# EasyEDA schematic SCH_Dual OPN MegaMod_2021-11-08.json

## Sheets
1 MAIN: TITLE: Sheet_1; REV: 1.0; Date: 2021-11-07; Sheet: 1/1; Drawn By: Denjhang; Company: Your Company
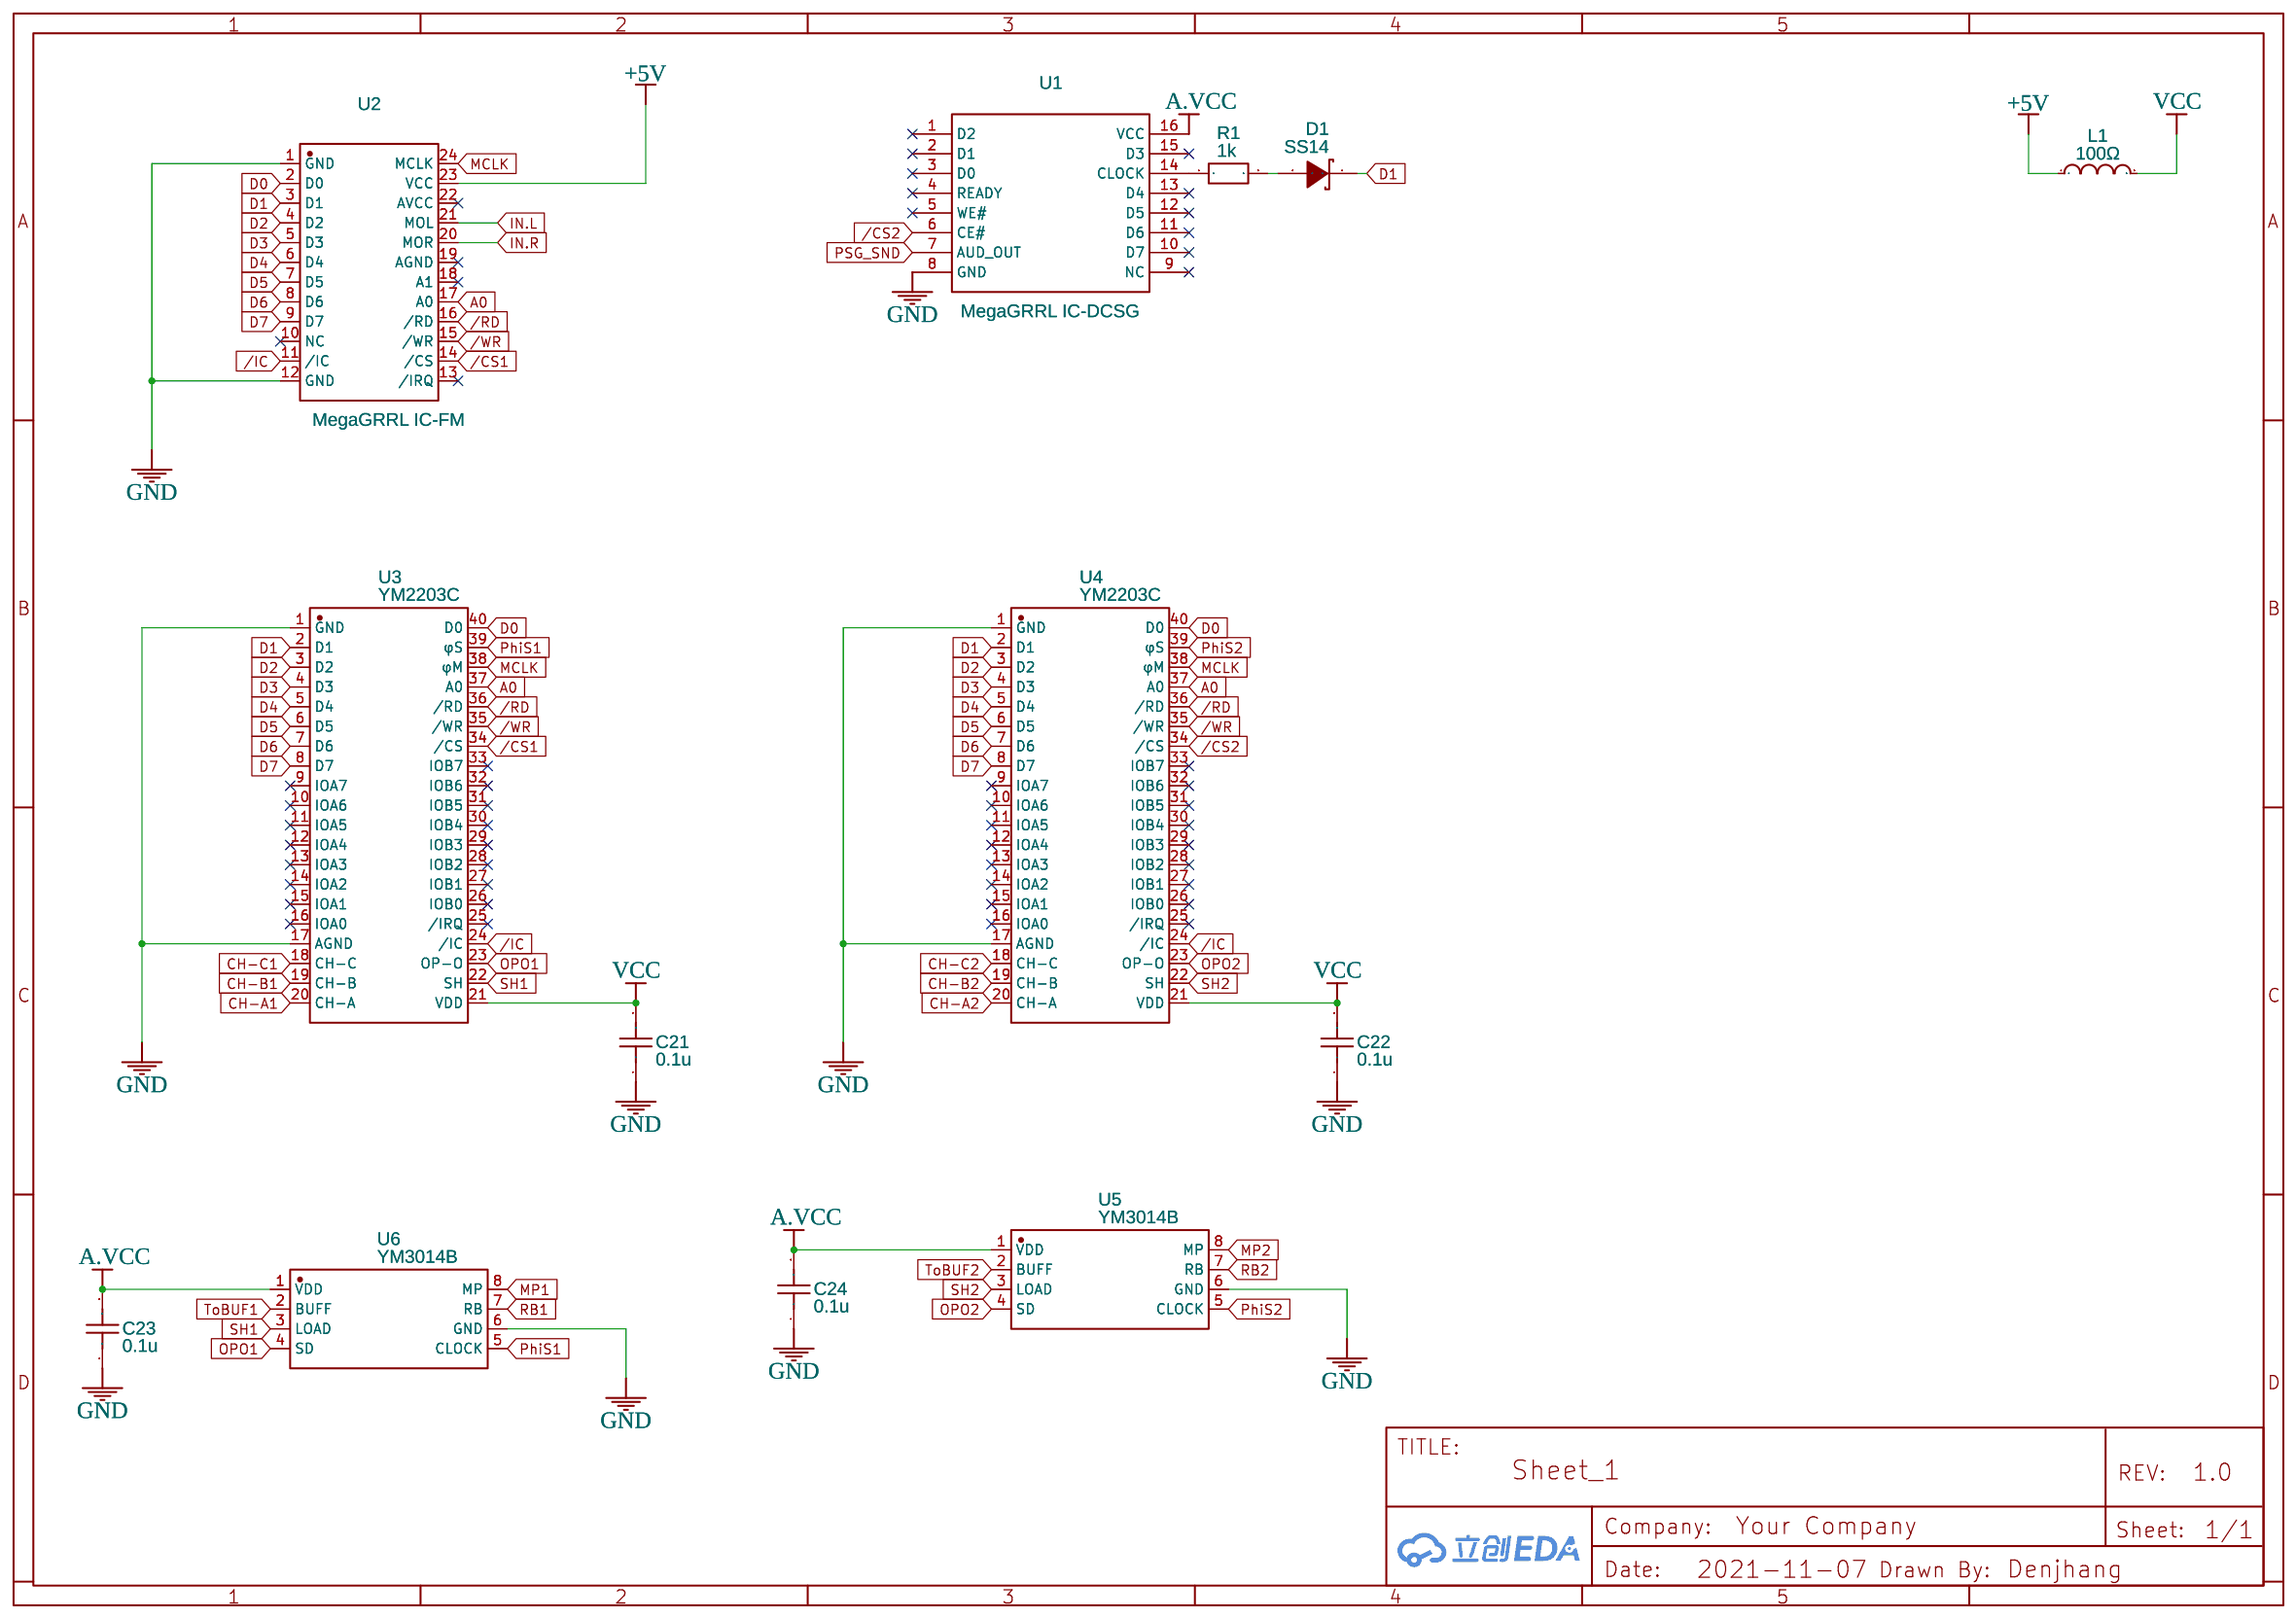
[diagram p0: MAIN]
2 MIX_PSG
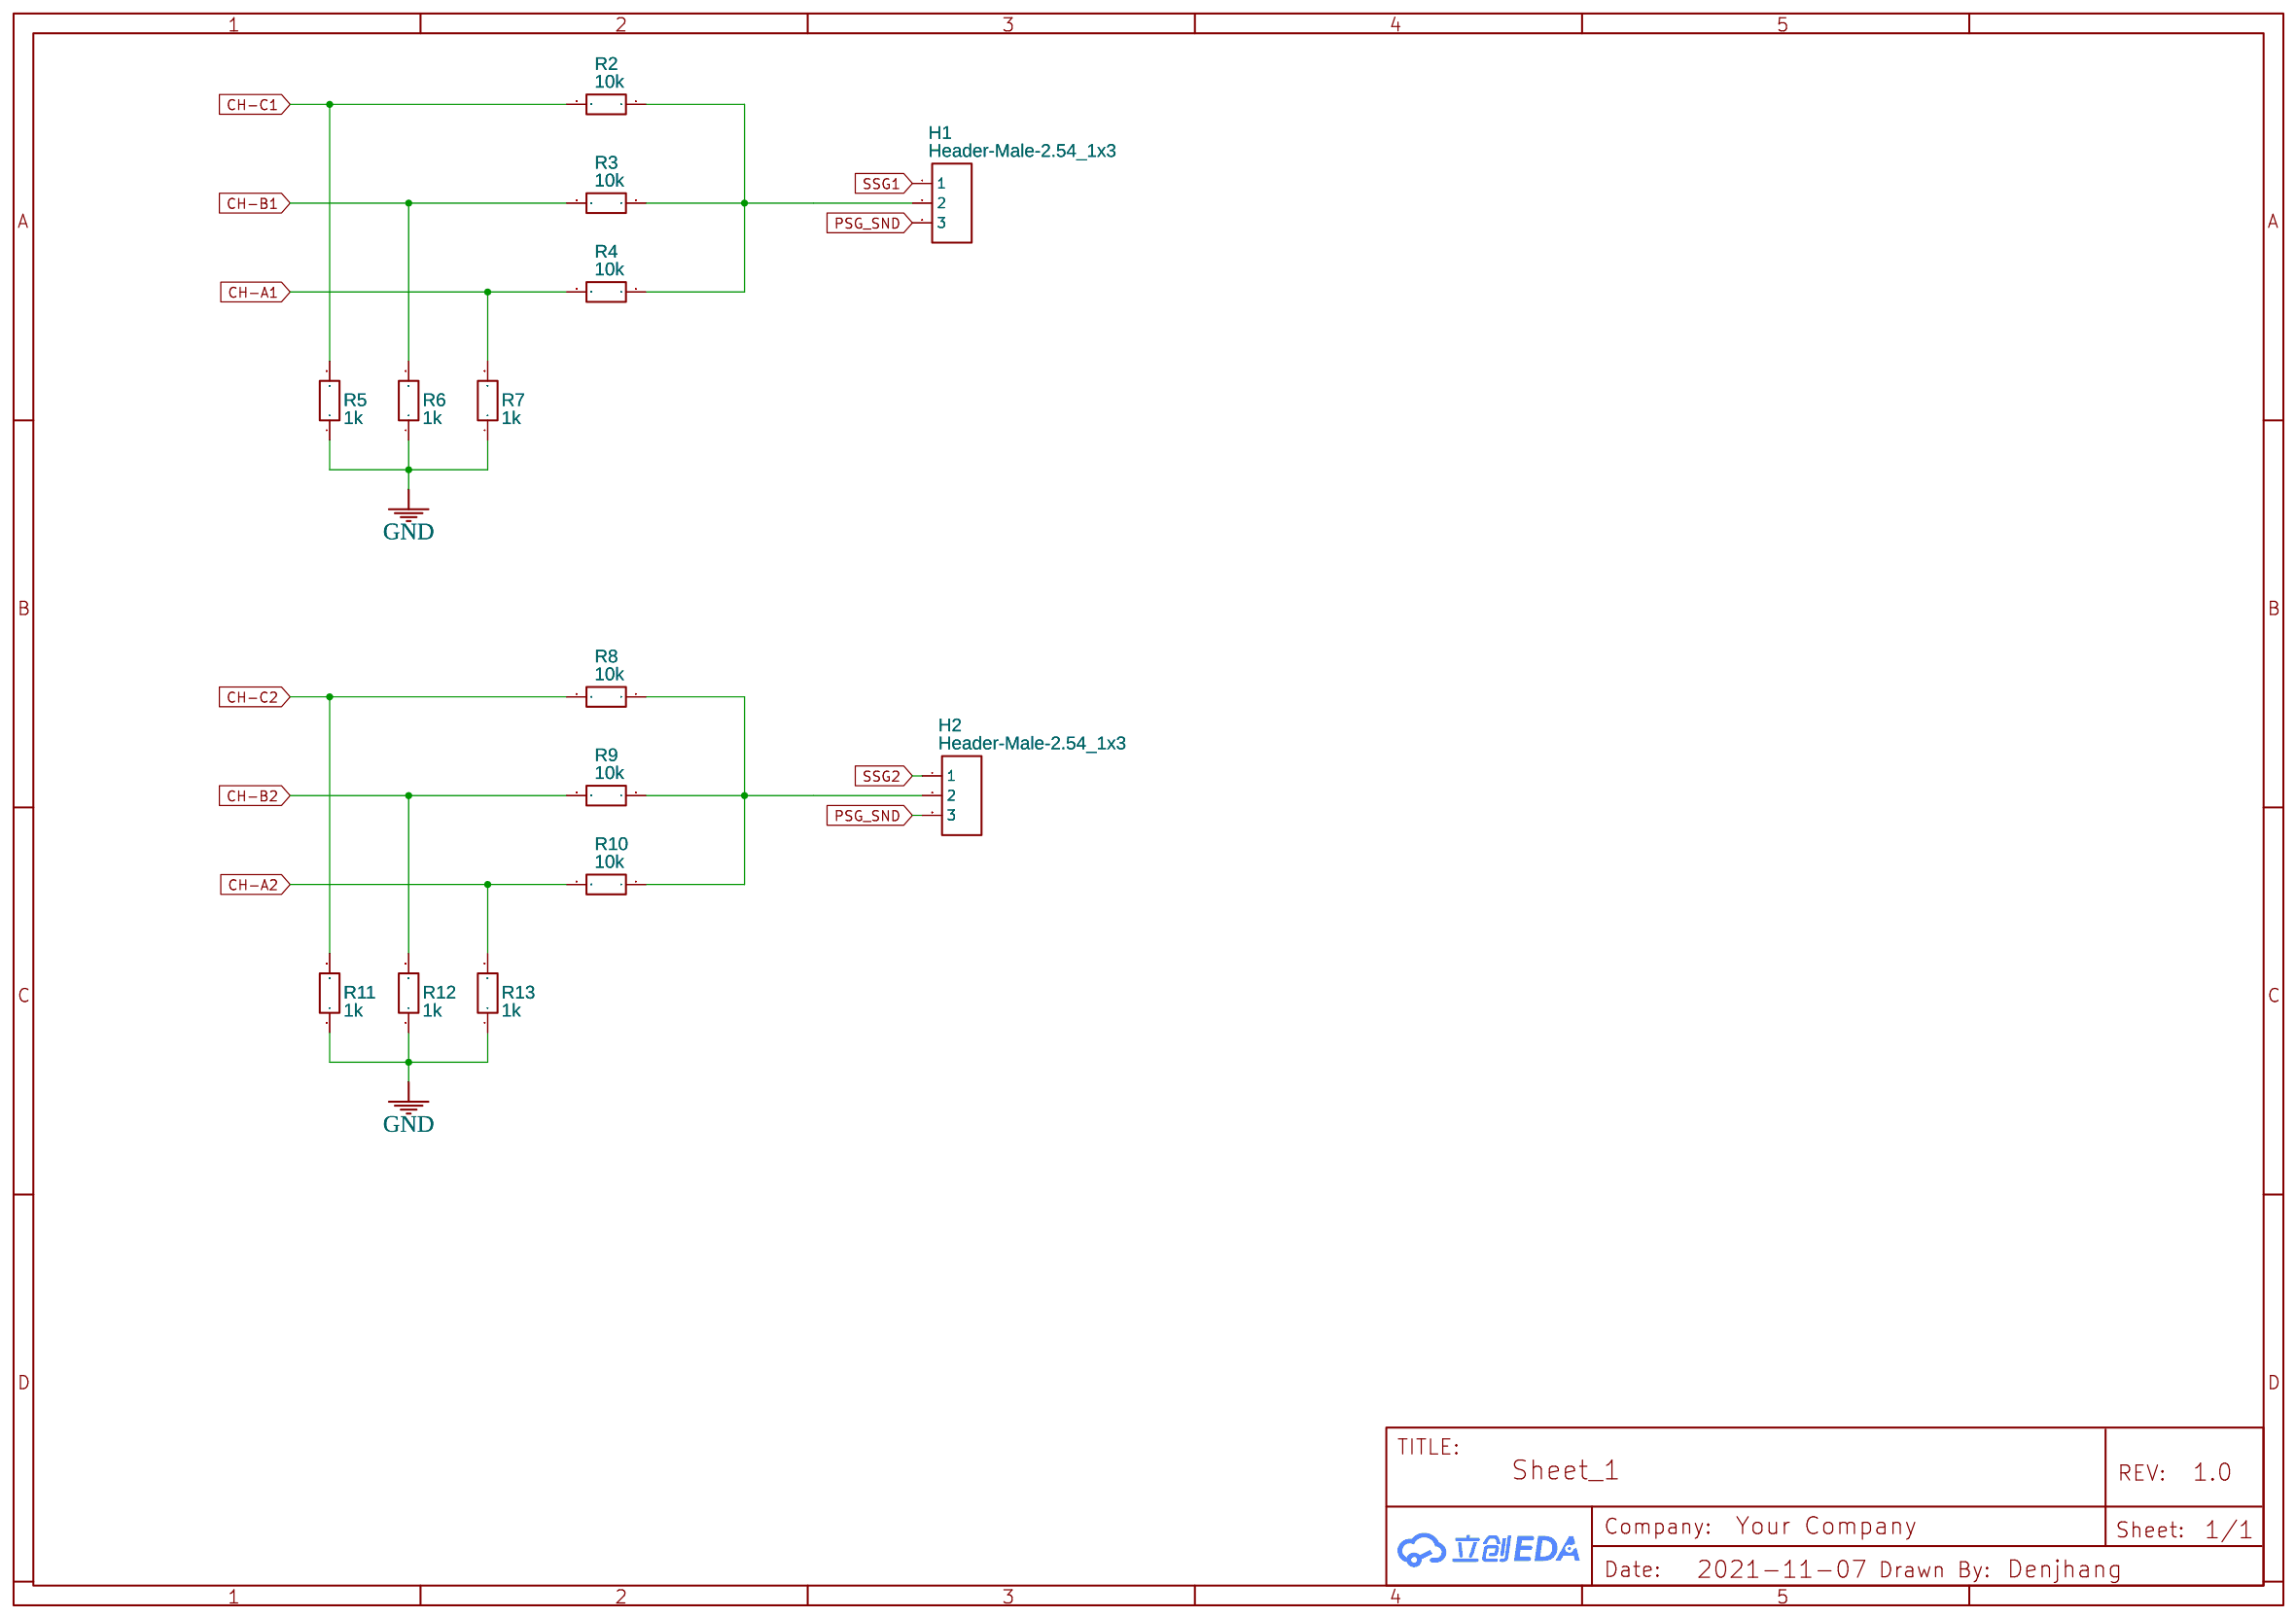
[diagram p1: MIX_PSG]
3 AMP_FM1
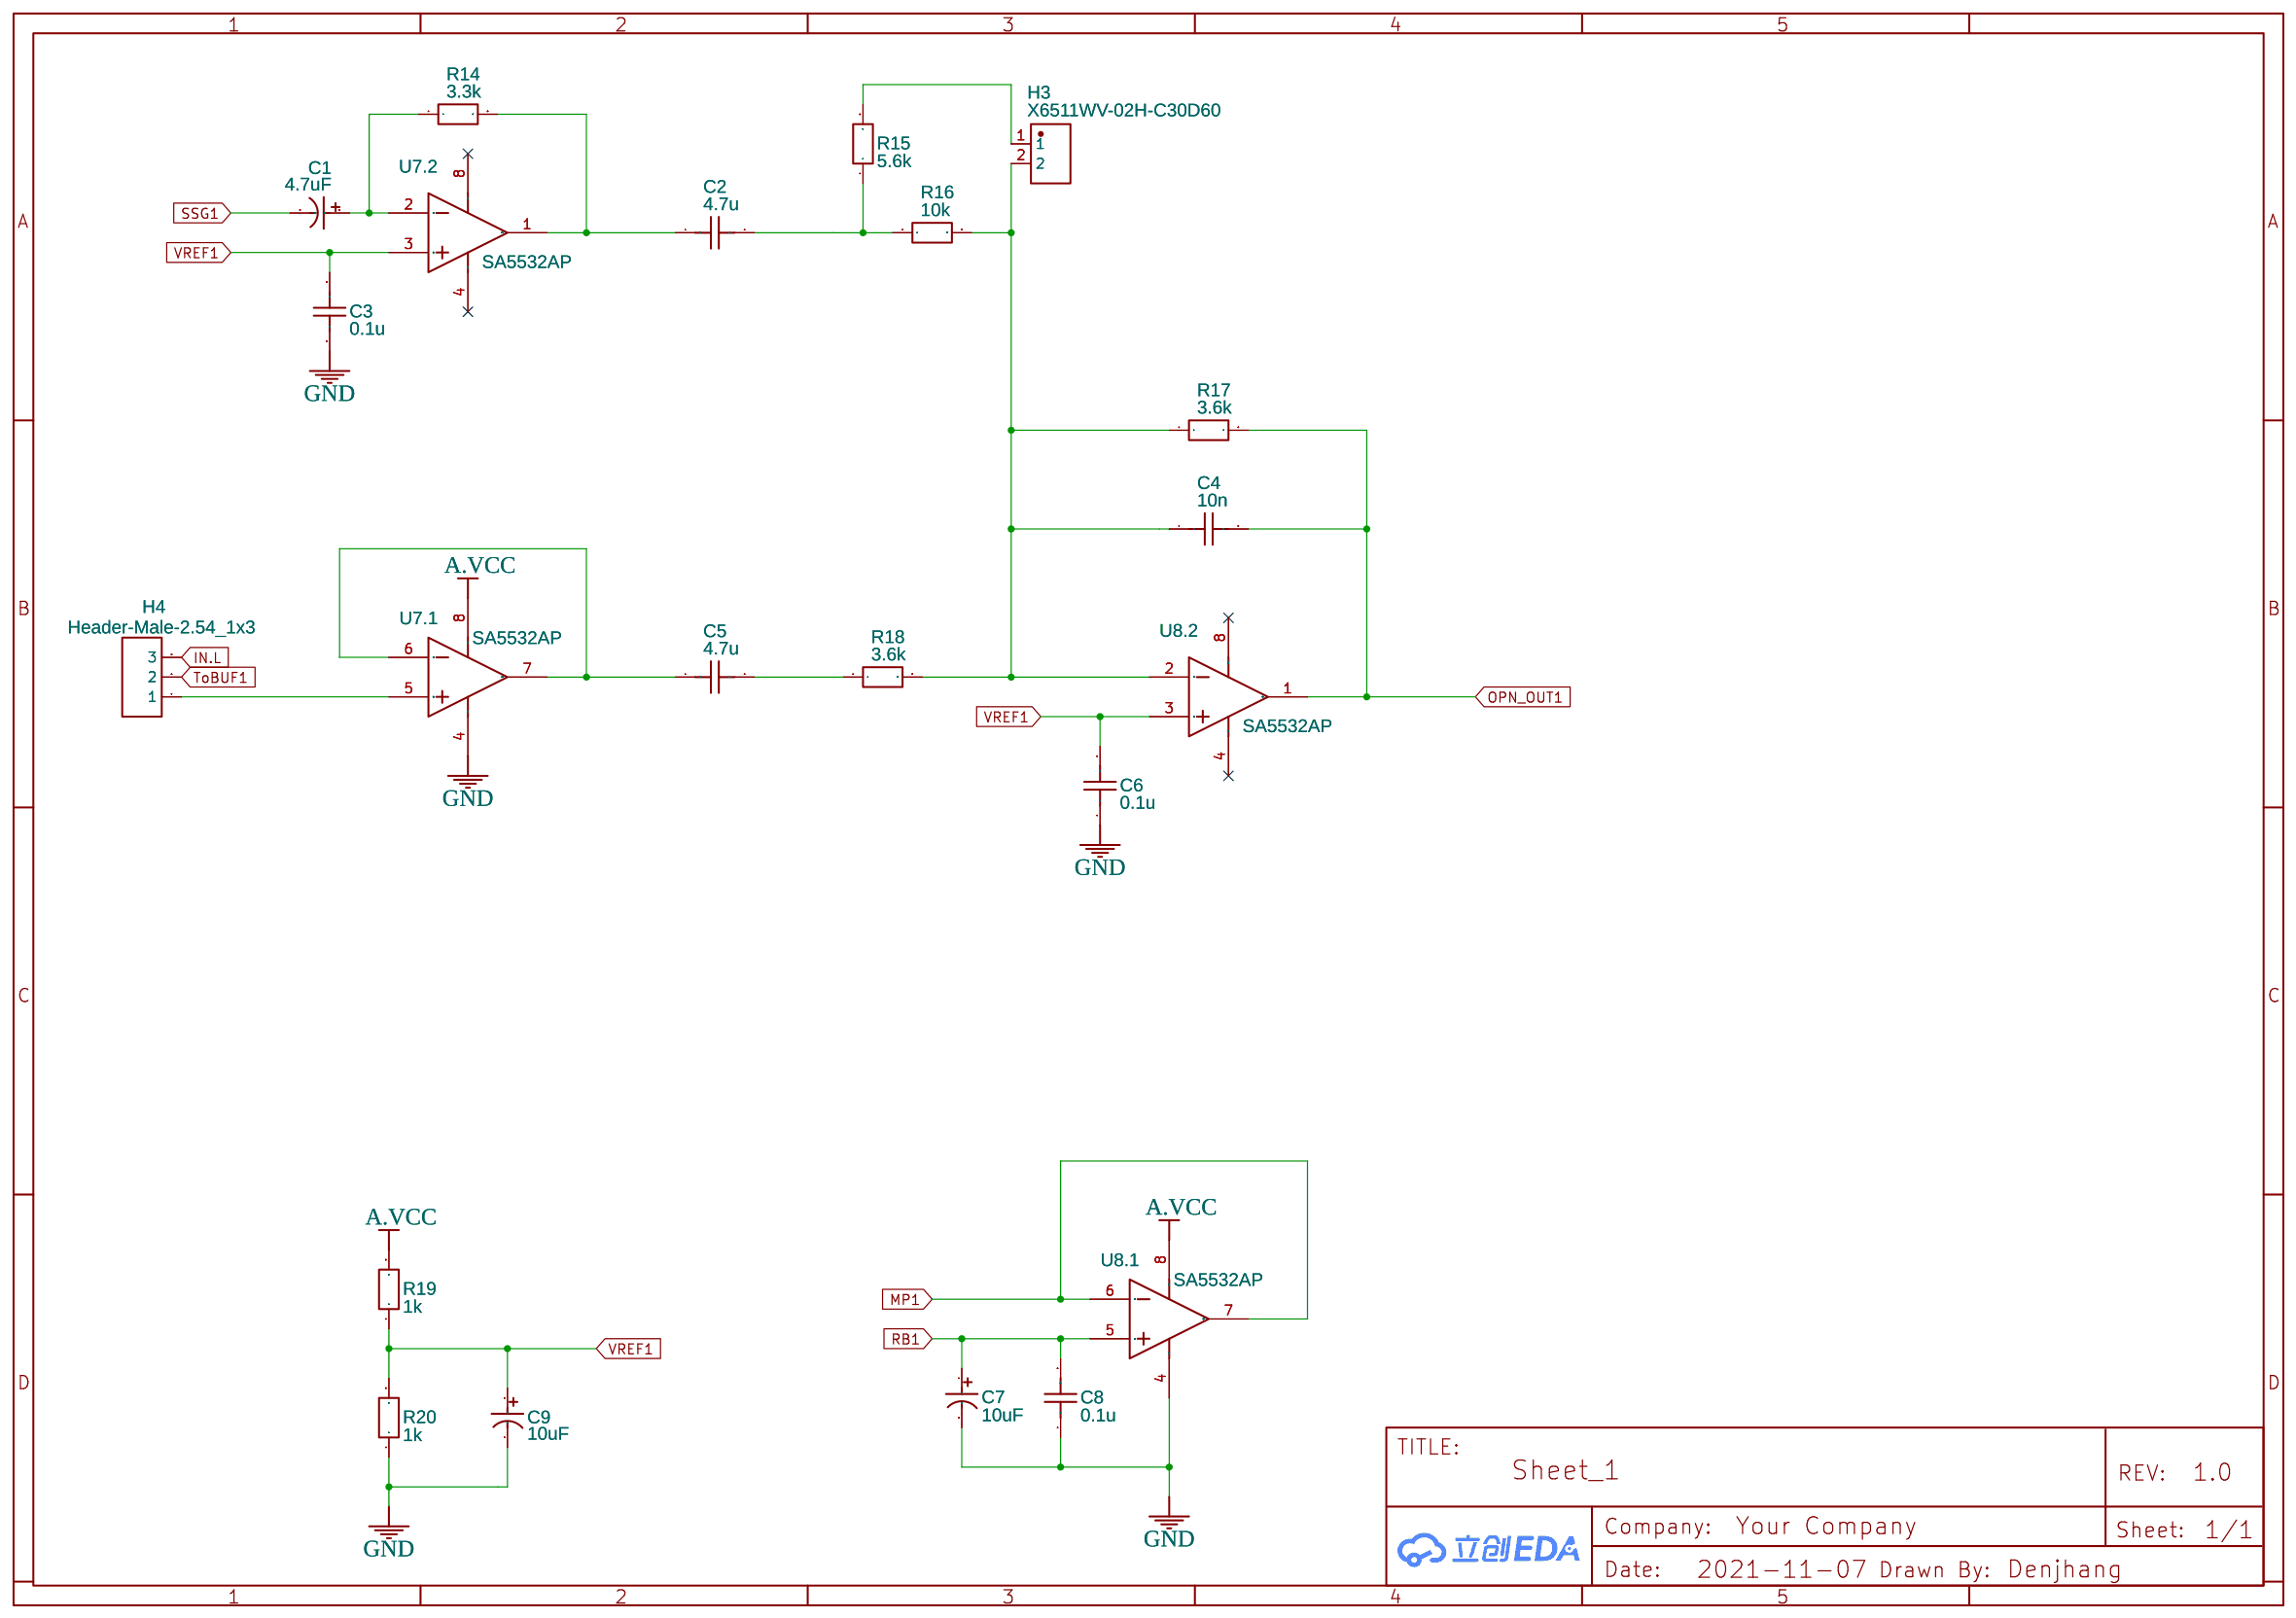
[diagram p2: AMP_FM1]
4 AMP_FM2
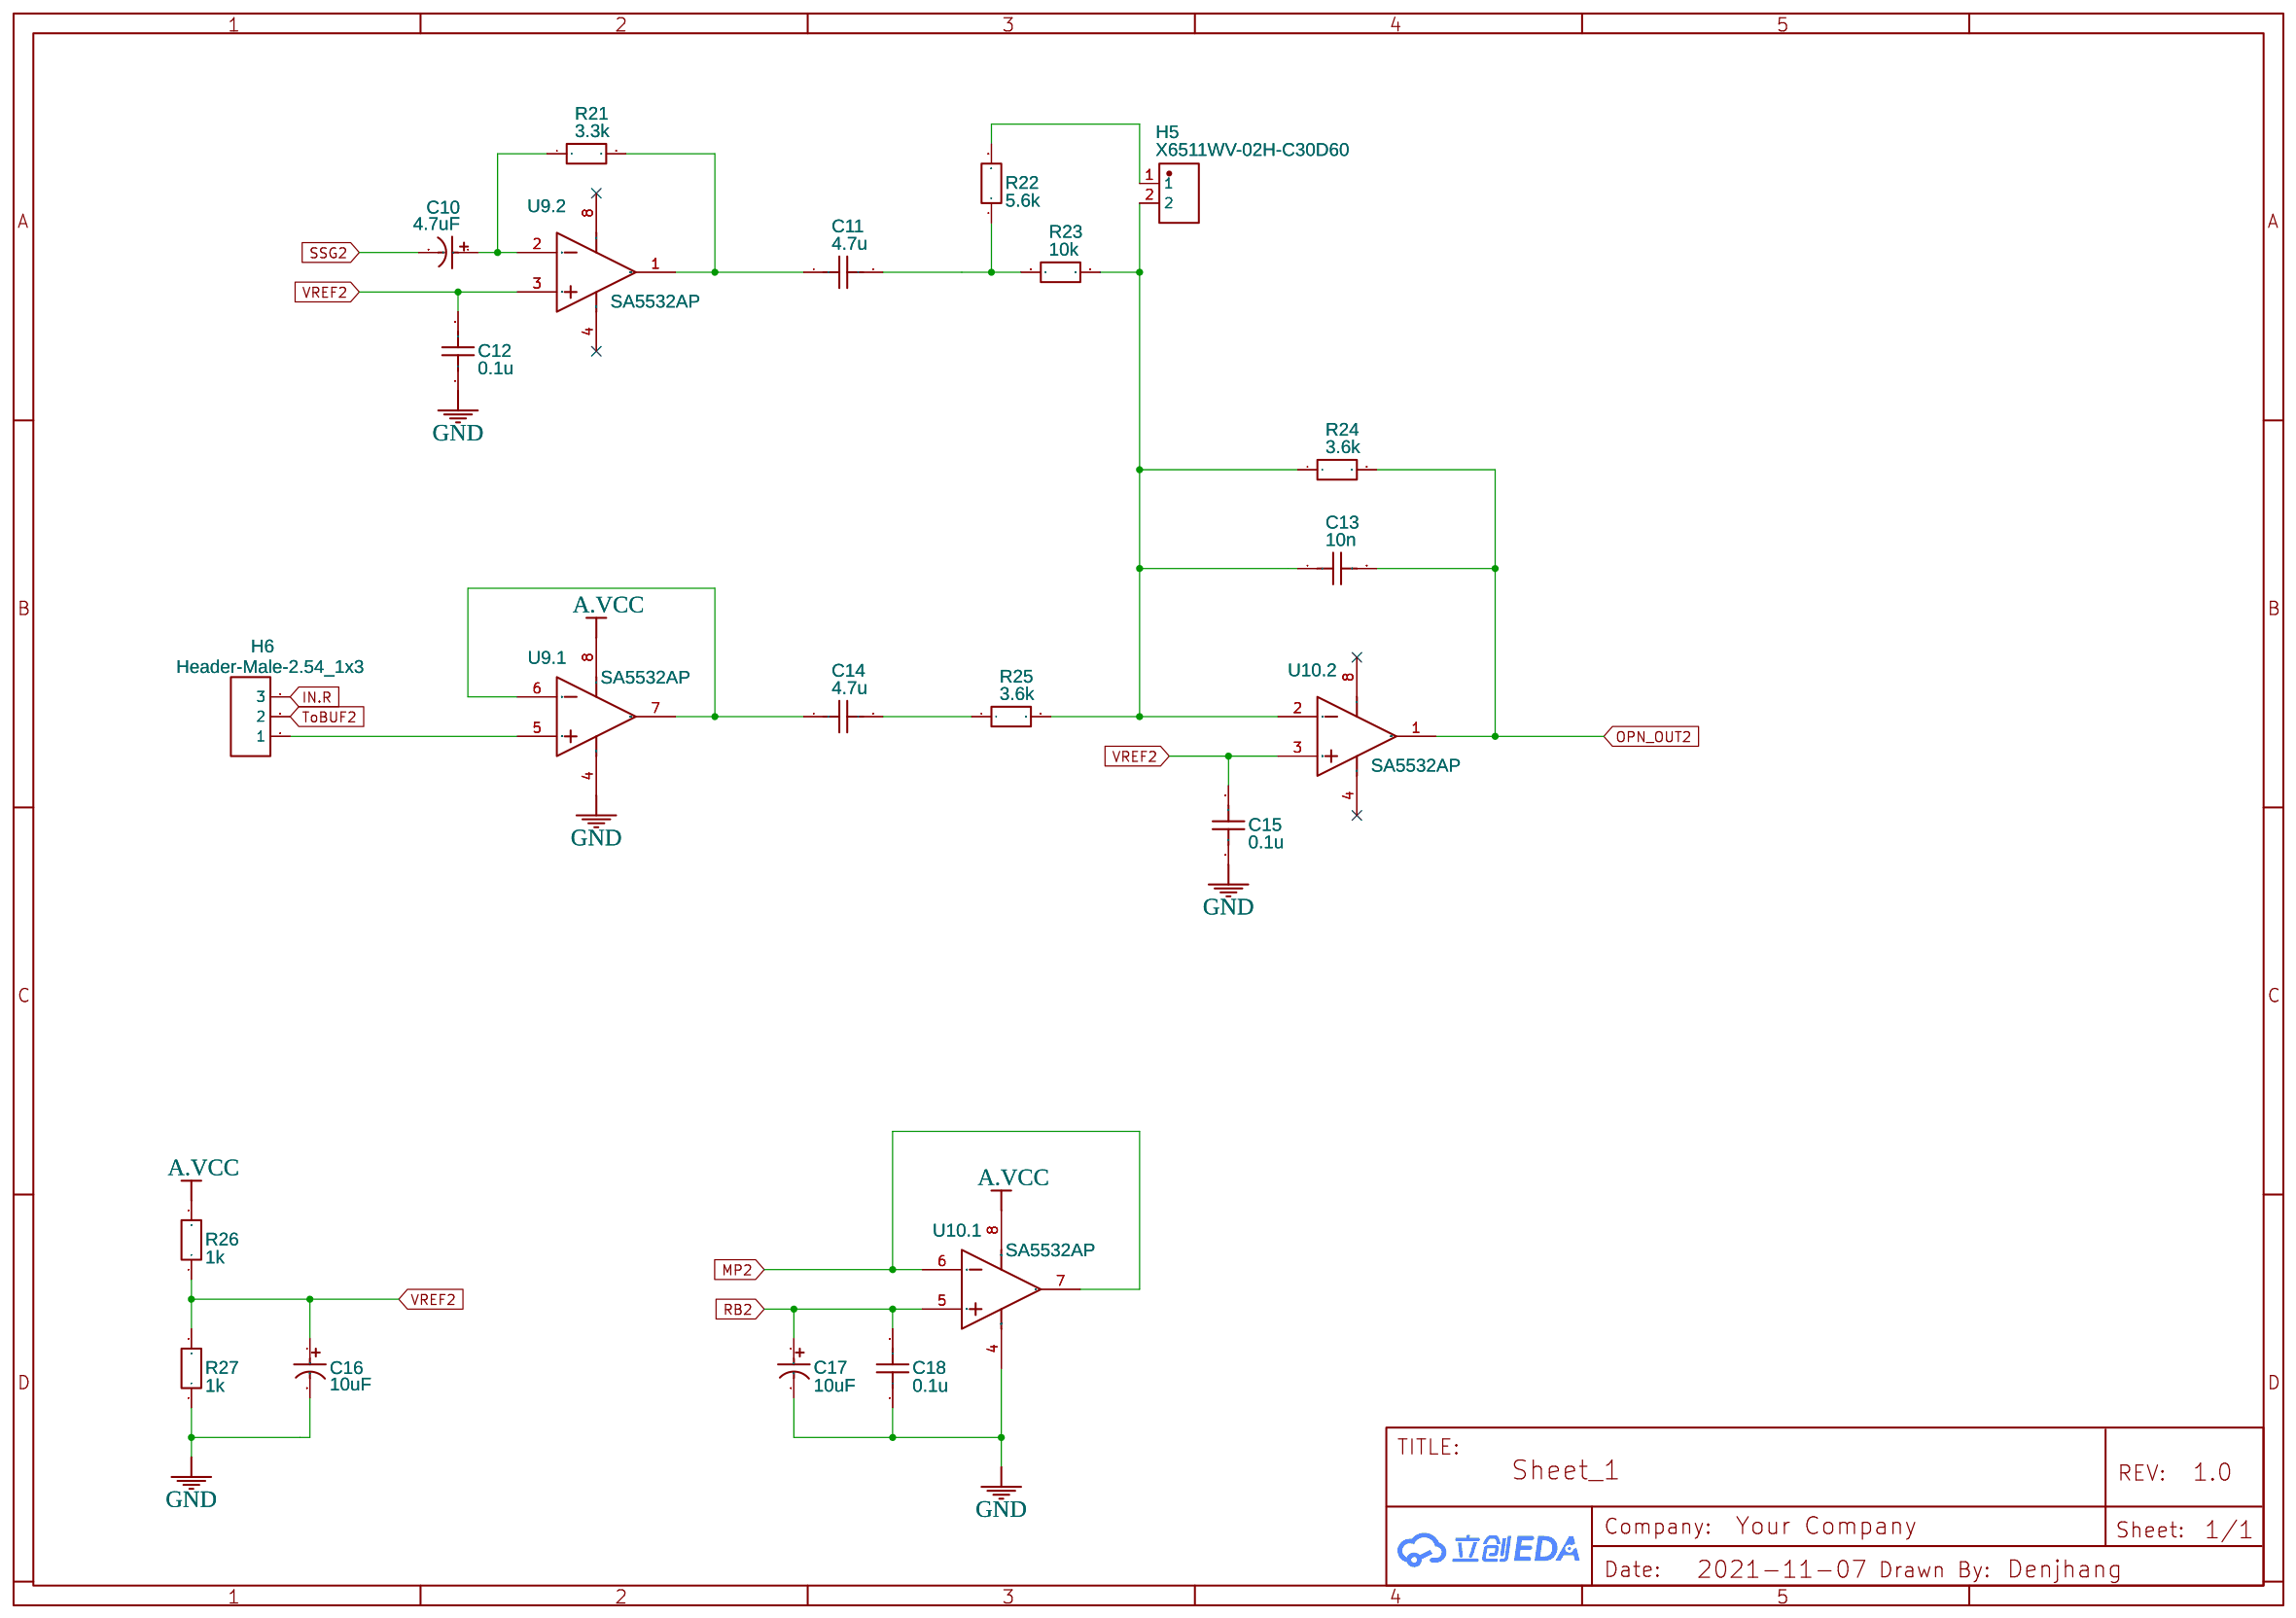
[diagram p3: AMP_FM2]
5 OUT
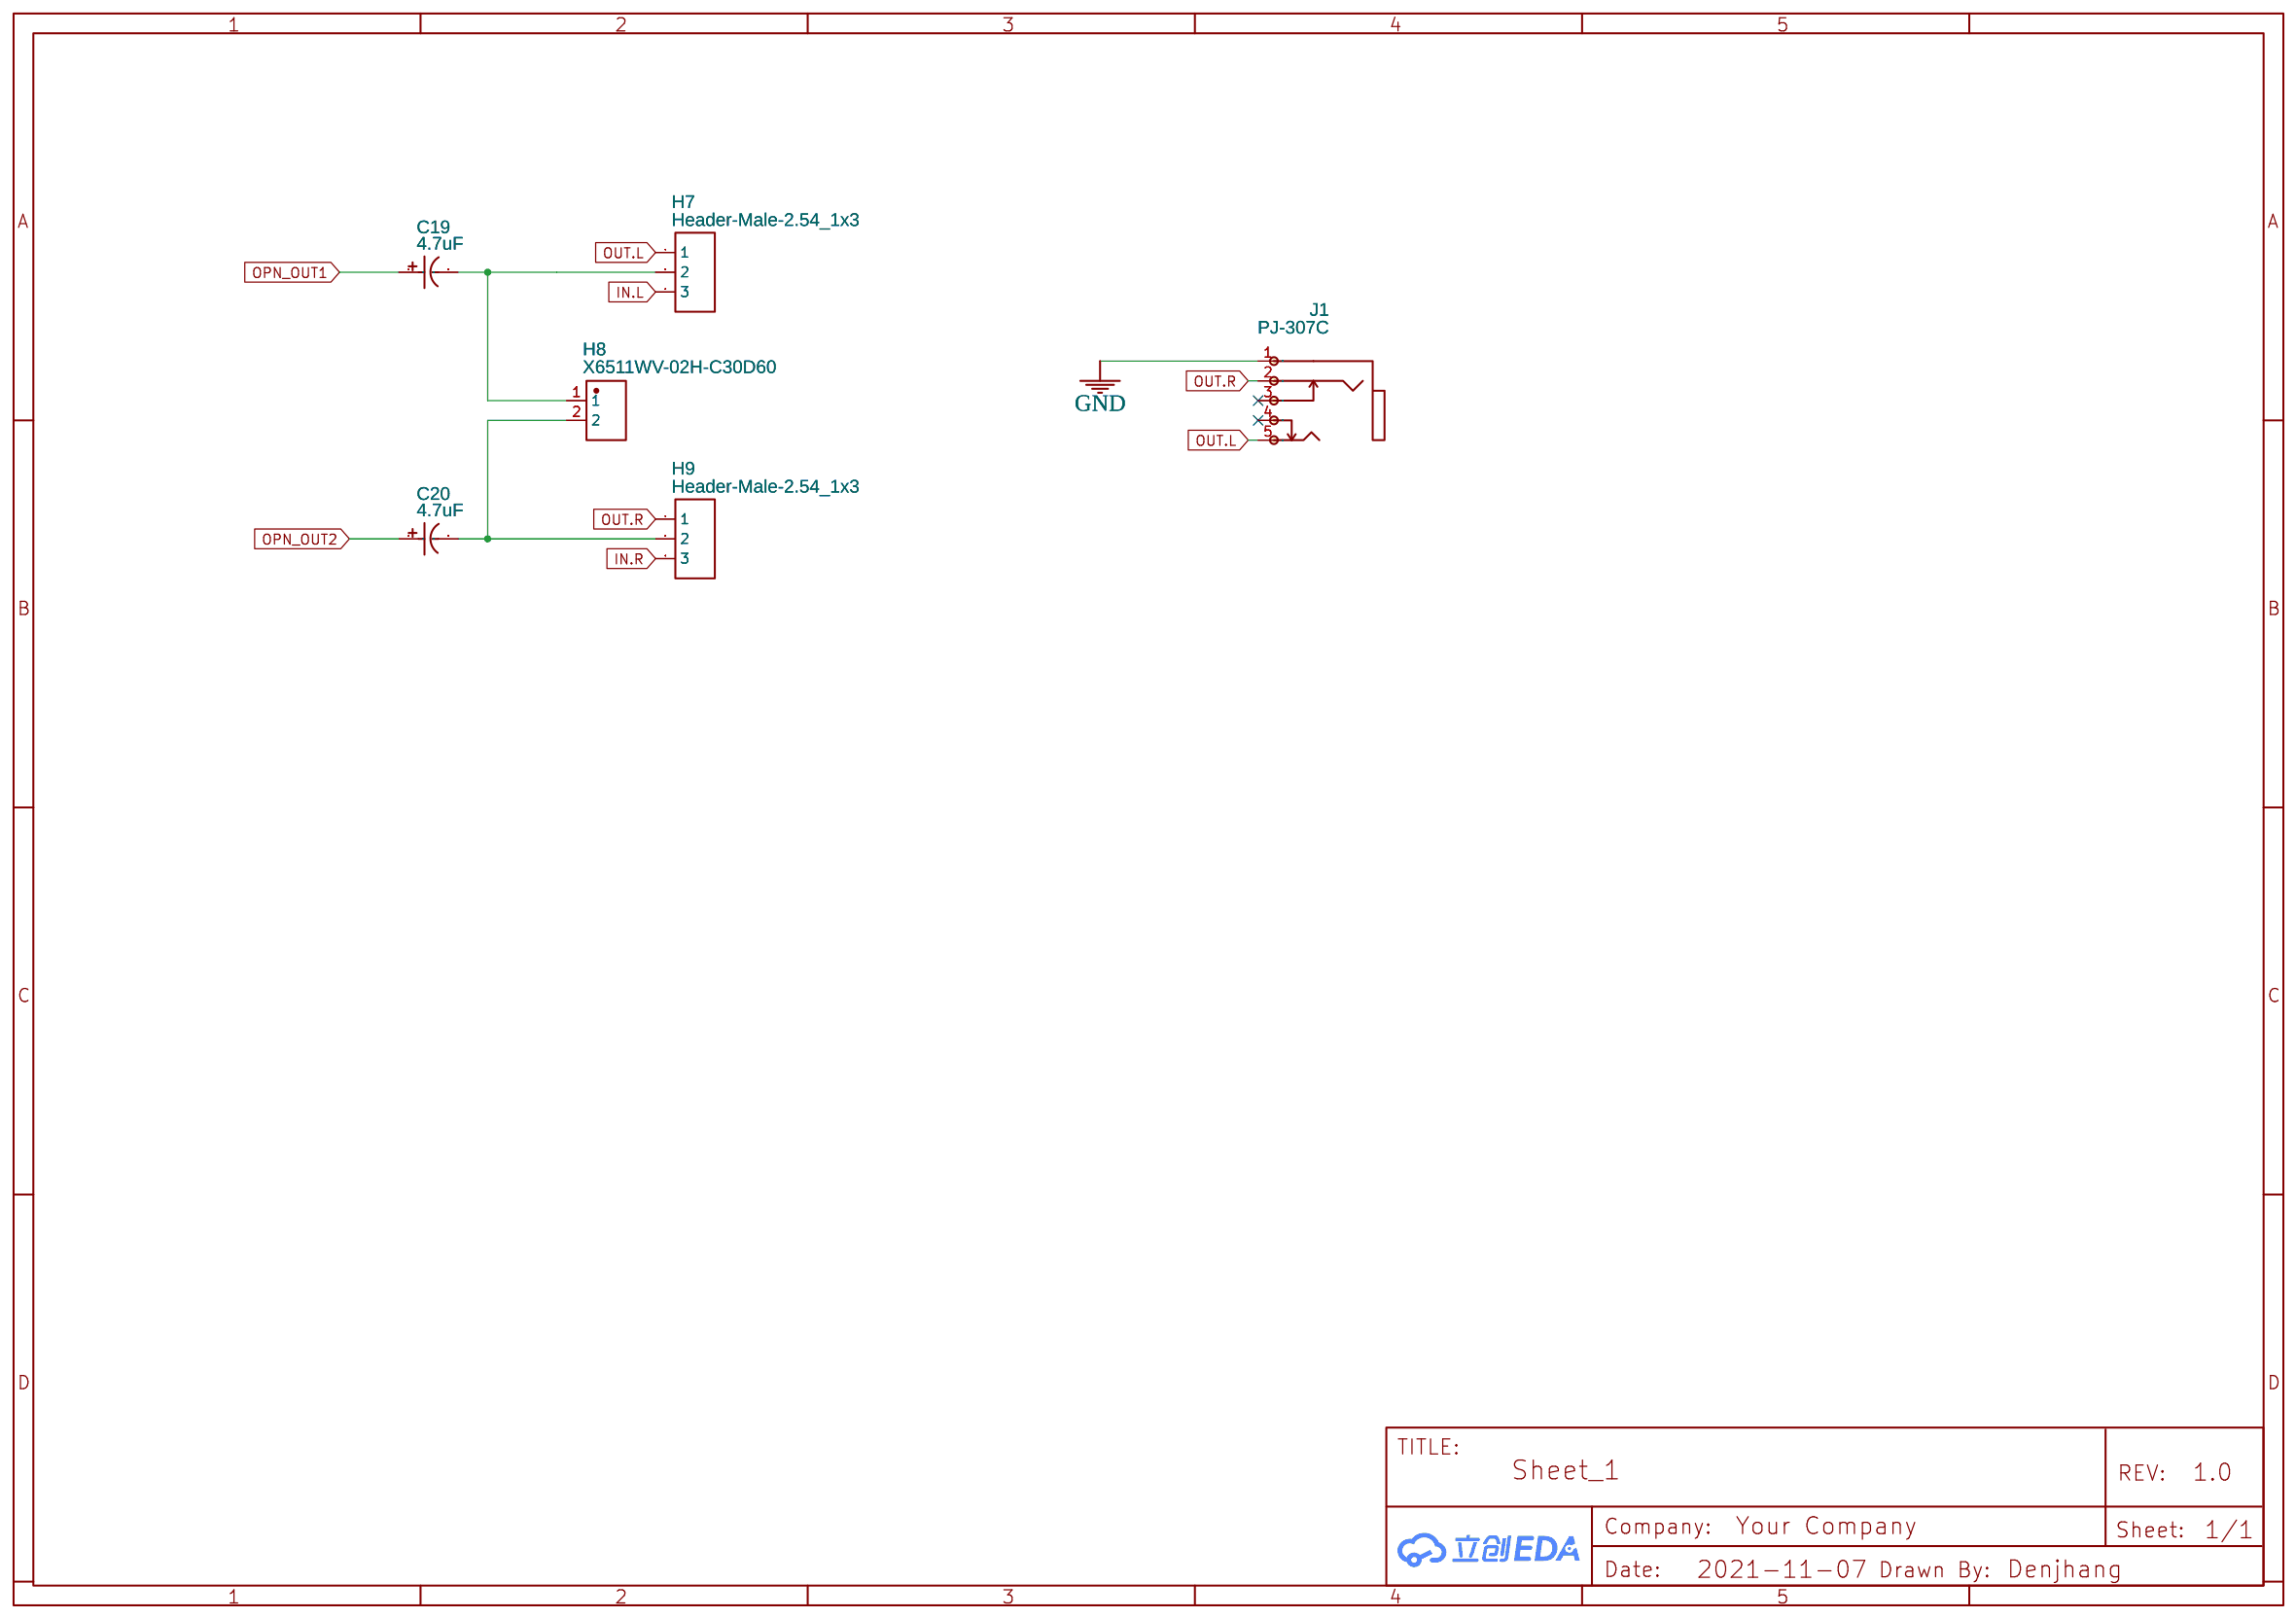
[diagram p4: OUT]

## Parts
sheet AMP_FM1
C1  4.7uF  [CAP-TH_BD6.3-P2.50-D1.0-FD]
C2  4.7u  [C0603]
C3  0.1u  [C0603]
C4  10n  [C0603]
C5  4.7u  [C0603]
C6  0.1u  [C0603]
C7  10uF  [CAP-TH_BD4.0-P1.50-D0.8-FD]
C8  0.1u  [C0603]
C9  10uF  [CAP-TH_BD6.3-P2.50-D1.0-FD]
H3  X6511WV-02H-C30D60  [HDR-TH_2P-P2.54-V-M]
H4  Header-Male-2.54_1x3  [HDR-TH_3P-P2.54-V-M-1]
R14  3.3k  [R0603]
R15  5.6k  [R0603]
R16  10k  [R0603]
R17  3.6k  [R0603]
R18  3.6k  [R0603]
R19  1k  [R0603]
R20  1k  [R0603]
U7  SA5532AP  [DIP8]  (sections 1,2)
U8  SA5532AP  [DIP8]  (sections 1,2)
sheet AMP_FM2
C10  4.7uF  [CAP-TH_BD6.3-P2.50-D1.0-FD]
C11  4.7u  [C0603]
C12  0.1u  [C0603]
C13  10n  [C0603]
C14  4.7u  [C0603]
C15  0.1u  [C0603]
C16  10uF  [CAP-TH_BD6.3-P2.50-D1.0-FD]
C17  10uF  [CAP-TH_BD4.0-P1.50-D0.8-FD]
C18  0.1u  [C0603]
H5  X6511WV-02H-C30D60  [HDR-TH_2P-P2.54-V-M]
H6  Header-Male-2.54_1x3  [HDR-TH_3P-P2.54-V-M-1]
R21  3.3k  [R0603]
R22  5.6k  [R0603]
R23  10k  [R0603]
R24  3.6k  [R0603]
R25  3.6k  [R0603]
R26  1k  [R0603]
R27  1k  [R0603]
U9  SA5532AP  [DIP8]  (sections 1,2)
U10  SA5532AP  [DIP8]  (sections 1,2)
sheet MAIN
C21  0.1u  [C0603]
C22  0.1u  [C0603]
C23  0.1u  [C0603]
C24  0.1u  [C0603]
D1  SS14  [SMA_L4.4-W2.8-LS5.4-RD]
L1  100Ω  [L0603]
R1  1k  [R0603]
U1  MegaGRRL IC-DCSG  [DIP-16_L20.4-W5.8-P2.54-LS7.6-BL]
U2  MegaGRRL IC-FM  [DIP-24_L32.0-W13.8-P2.54-LS15.6-BL]
U3  YM2203C  [DIP40]
U4  YM2203C  [DIP40]
U5  YM3014B  [DIP8-2.54-10.9X6.6MM]
U6  YM3014B  [DIP8-2.54-10.9X6.6MM]
sheet MIX_PSG
H1  Header-Male-2.54_1x3  [HDR-TH_3P-P2.54-V-M-1]
H2  Header-Male-2.54_1x3  [HDR-TH_3P-P2.54-V-M-1]
R2  10k  [R0603]
R3  10k  [R0603]
R4  10k  [R0603]
R5  1k  [R0603]
R6  1k  [R0603]
R7  1k  [R0603]
R8  10k  [R0603]
R9  10k  [R0603]
R10  10k  [R0603]
R11  1k  [R0603]
R12  1k  [R0603]
R13  1k  [R0603]
sheet OUT
C19  4.7uF  [CAP-TH_BD6.3-P2.50-D1.0-FD]
C20  4.7uF  [CAP-TH_BD6.3-P2.50-D1.0-FD]
H7  Header-Male-2.54_1x3  [HDR-TH_3P-P2.54-V-M-1]
H8  X6511WV-02H-C30D60  [HDR-TH_2P-P2.54-V-M]
H9  Header-Male-2.54_1x3  [HDR-TH_3P-P2.54-V-M-1]
J1  PJ-307C  [AUDIO-TH_PJ307C]

## Library data of the parts
C1 C9 C10 C16 C19 C20 = 25V 47uF: Supplier: LCSC; Manufacturer: ValuePro; Manufacturer Part: 电解电容25V 47uF; Supplier Part: C45704; JLCPCB Part Class: Extended Part
C2-C6 C8 C11-C15 C18 C21-C24 = C_0603_US: Contributor: LCEDA_Lib
C7 C17 = 47uF 10V 4*5: Supplier: LCSC; Manufacturer: ValuePro; Supplier Part: C43312; JLCPCB Part Class: Extended Part
H3 H5 H8 = X6511WV-02H-C30D60: Supplier: LCSC; Supplier Part: C706874; Manufacturer: XKB Connectivity; Contributor: LCSC; JLCPCB Part Class: Extended Part
H1 H2 H4 H6 H7 H9 = Header-Male-2.54_1x3: Supplier: LCSC; Manufacturer: BOOMELE; Manufacturer Part: Header2.54mm 1*3P; Supplier Part: C49257; JLCPCB Part Class: Extended Part
R1-R27 = R_0603_EU: Contributor: LCEDA_Lib
U7-U10 = SA5532AP: Dual Low-Noise Operational Amplifier, 10 to 30 V, -40 to 85 degC, 8-pin DIP (P8), Pb-Free (RoHS); subpart_no: 1
D1 = SS14: Supplier: LCSC; Manufacturer: MDD; Supplier Part: C2480; JLCPCB Part Class: Basic Part
L1 = CBW160808U102T: Supplier: LCSC; Manufacturer: FH; Supplier Part: C50069; JLCPCB Part Class: Extended Part
U1 = SN76489AN: Manufacturer: Texas Instruments; Contributor: re1mu
U2 = MegaGRRL IC-FM: Supplier Part: C707077; Manufacturer: YAMAHA; Manufacturer Part: YM2612; Contributor: Denjhang; JLCPCB SMD: Yes; SMT Type: Extend
U3 U4 = YM2203C: Contributor: Denjhang
U5 U6 = YM3014B: Contributor: lizaer012
J1 = PJ-307C: Supplier: LCSC; Manufacturer: BOOMELE; Supplier Part: C16684; JLCPCB Part Class: Extended Part

## Nets
+5V: L1.1 U2.23(VCC)
GND: C3.1 C6.1 C7.2 C8.1 C9.2 C12.1 C15.1 C16.2 C17.2 C18.1 C21.1 C22.1 C23.1 C24.1 J1.1 R5.1 R6.1 R7.1 R11.1 R12.1 R13.1 R20.1 R27.1 U1.8(GND) U2.1(GND) U2.12(GND) U3.1(GND) U3.17(AGND) U4.1(GND) U4.17(AGND) U5.6(GND) U6.6(GND) U7.4(VCC-) U8.4(VCC-) U9.4(VCC-) U10.4(VCC-)
VCC: C21.2 C22.2 L1.2 U3.21(VDD) U4.21(VDD)
/CS1: U2.14(/CS) U3.34(/CS)
/CS2: U1.6(CE#) U4.34(/CS)
/IC: U2.11(/IC) U3.24(/IC) U4.24(/IC)
/RD: U2.16(/RD) U3.36(/RD) U4.36(/RD)
/WR: U2.15(/WR) U3.35(/WR) U4.35(/WR)
A0: U2.17(A0) U3.37(A0) U4.37(A0)
A.VCC: C23.2 C24.2 R19.2 R26.2 U1.16(VCC) U5.1(VDD) U6.1(VDD) U7.8(VCC+) U8.8(VCC+) U9.8(VCC+) U10.8(VCC+)
CH-A1: R4.2 R7.2 U3.20(CH-A)
CH-A2: R10.2 R13.2 U4.20(CH-A)
CH-B1: R3.2 R6.2 U3.19(CH-B)
CH-B2: R9.2 R12.2 U4.19(CH-B)
CH-C1: R2.2 R5.2 U3.18(CH-C)
CH-C2: R8.2 R11.2 U4.18(CH-C)
D0: U2.2(D0) U3.40(D0) U4.40(D0)
D1: D1.1(K) U2.3(D1) U3.2(D1) U4.2(D1)
D2: U2.4(D2) U3.3(D2) U4.3(D2)
D3: U2.5(D3) U3.4(D3) U4.4(D3)
D4: U2.6(D4) U3.5(D4) U4.5(D4)
D5: U2.7(D5) U3.6(D5) U4.6(D5)
D6: U2.8(D6) U3.7(D6) U4.7(D6)
D7: U2.9(D7) U3.8(D7) U4.8(D7)
IN.L: H4.3 H7.3 U2.21(MOL)
IN.R: H6.3 H9.3 U2.20(MOR)
MCLK: U2.24(MCLK) U3.38(φM) U4.38(φM)
MP1: U6.8(MP) U8.6(IN2-) U8.7(OUT2)
MP2: U5.8(MP) U10.6(IN2-) U10.7(OUT2)
OPN_OUT1: C4.2 C19.1 R17.2 U8.1(OUT1)
OPN_OUT2: C13.2 C20.1 R24.2 U10.1(OUT1)
OPO1: U3.23(OP-O) U6.4(SD)
OPO2: U4.23(OP-O) U5.4(SD)
OUT.L: H7.1 J1.5
OUT.R: H9.1 J1.2
PhiS1: U3.39(φS) U6.5(CLOCK)
PhiS2: U4.39(φS) U5.5(CLOCK)
PSG_SND: H1.3 H2.3 U1.7(AUD OUT)
RB1: C7.1 C8.2 U6.7(RB) U8.5(IN2+)
RB2: C17.1 C18.2 U5.7(RB) U10.5(IN2+)
SH1: U3.22(SH) U6.3(LOAD)
SH2: U4.22(SH) U5.3(LOAD)
SSG1: C1.2 H1.1
SSG2: C10.2 H2.1
ToBUF1: H4.2 U6.2(BUFF)
ToBUF2: H6.2 U5.2(BUFF)
VREF1: C3.2 C6.2 C9.1 R19.1 R20.2 U7.3(IN1+) U8.3(IN1+)
VREF2: C12.2 C15.2 C16.1 R26.1 R27.2 U9.3(IN1+) U10.3(IN1+)
Net-(C1-1): C1.1 R14.1 U7.2(IN1-)
Net-(C2-1): C2.1 R14.2 U7.1(OUT1)
Net-(C2-2): C2.2 R15.1 R16.1
Net-(C4-1): C4.1 H3.2 R16.2 R17.1 R18.2 U8.2(IN1-)
Net-(C5-1): C5.1 U7.6(IN2-) U7.7(OUT2)
Net-(C5-2): C5.2 R18.1
Net-(C10-1): C10.1 R21.1 U9.2(IN1-)
Net-(C11-1): C11.1 R21.2 U9.1(OUT1)
Net-(C11-2): C11.2 R22.1 R23.1
Net-(C13-1): C13.1 H5.2 R23.2 R24.1 R25.2 U10.2(IN1-)
Net-(C14-1): C14.1 U9.6(IN2-) U9.7(OUT2)
Net-(C14-2): C14.2 R25.1
Net-(C19-2): C19.2 H7.2 H8.1
Net-(C20-2): C20.2 H8.2 H9.2
Net-(D1-2): D1.2(A) R1.2
Net-(H1-2): H1.2 R2.1 R3.1 R4.1
Net-(H2-2): H2.2 R8.1 R9.1 R10.1
Net-(H3-1): H3.1 R15.2
Net-(H4-1): H4.1 U7.5(IN2+)
Net-(H5-1): H5.1 R22.2
Net-(H6-1): H6.1 U9.5(IN2+)
Net-(R1-1): R1.1 U1.14(CLOCK)

Not connected (* = marked no-connect by the designer): J1 3* 4*; U1 1(D2)* 2(D1)* 3(D0)* 4(READY)* 5(WE#)* 9(NC)* 10(D7)* 11(D6)* 12(D5)* 13(D4)* 15(D3)*; U2 10(NC)* 13(/IRQ)* 18(A1)* 19(AGND)* 22(AVCC)*; U3 9(IOA7)* 10(IOA6)* 11(IOA5)* 12(IOA4)* 13(IOA3)* 14(IOA2)* 15(IOA1)* 16(IOA0)* 25(/IRQ)* 26(IOB0)* 27(IOB1)* 28(IOB2)* 29(IOB3)* 30(IOB4)* 31(IOB5)* 32(IOB6)* 33(IOB7)*; U4 9(IOA7)* 10(IOA6)* 11(IOA5)* 12(IOA4)* 13(IOA3)* 14(IOA2)* 15(IOA1)* 16(IOA0)* 25(/IRQ)* 26(IOB0)* 27(IOB1)* 28(IOB2)* 29(IOB3)* 30(IOB4)* 31(IOB5)* 32(IOB6)* 33(IOB7)*
